# Altium schematic sheet Spindle_Control.SchDoc: STM32F446 CNC
size B; Author: AM; CompanyName: Expatria Technologies; DrawnBy: A.Marles; Engineer: AM; Organization: Expatria Technolgoies; DocumentNumber: 5; SheetNumber: 5; SheetTotal: 14
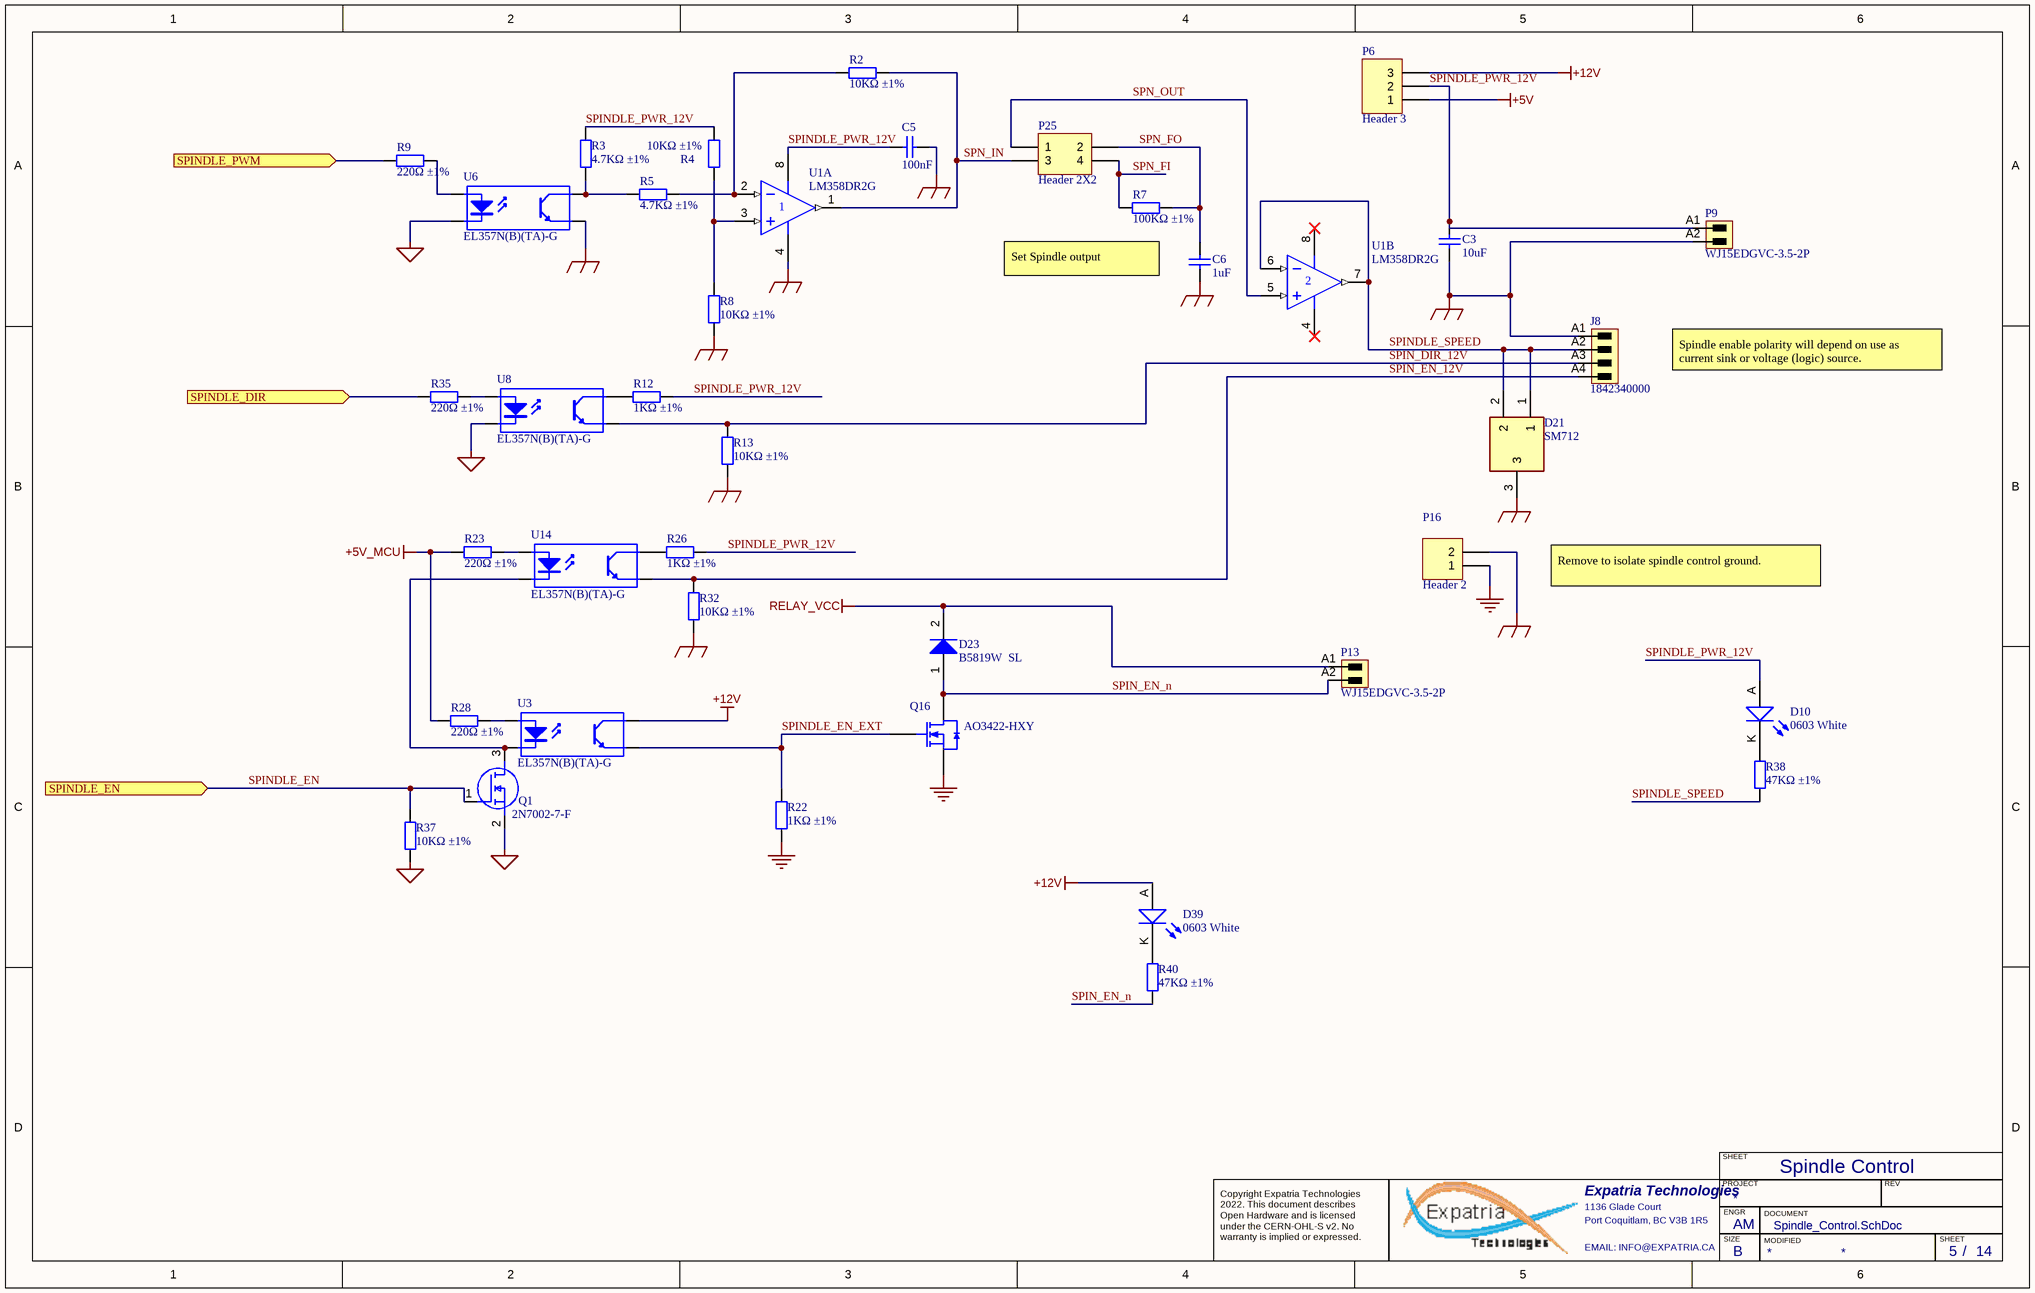
[diagram p0: Spindle_Control.SchDoc]

## Parts
C3  10uF  [1206_C]
C5  100nF  [0603_C]
C6  1uF  [0603_C]
D10  0603 White  [0603_LED_S1]
D21  SM712  [SOT95P230X117-3N]
D23  B5819W  SL  [SOD-123]
D39  0603 White  [0603_LED_S1]
J8  1842340000  [691321100004]
P6  Header 3  [HDR1X3]
P9  WJ15EDGVC-3.5-2P  [691321100002]
P13  WJ15EDGVC-3.5-2P  [691321100002]
P16  Header 2  [HDR1X2]
P25  Header 2X2  [HDR2X2]
Q1  2N7002-7-F  [SOT-23(SOT-23-3)]
Q16  AO3422-HXY  [SOT-23-3L]
R2  10KΩ ±1%  [0603_R]
R3  4.7KΩ ±1%  [0603_R]
R4  10KΩ ±1%  [0603_R]
R5  4.7KΩ ±1%  [0603_R]
R7  100KΩ ±1%  [0603_R]
R8  10KΩ ±1%  [0603_R]
R9  220Ω ±1%  [0402_R]
R12  1KΩ ±1%  [0603_R]
R13  10KΩ ±1%  [0603_R]
R22  1KΩ ±1%  [0603_R]
R23  220Ω ±1%  [0603_R]
R26  1KΩ ±1%  [0603_R]
R28  220Ω ±1%  [0603_R]
R32  10KΩ ±1%  [0603_R]
R35  220Ω ±1%  [0402_R]
R37  10KΩ ±1%  [0603_R]
R38  47KΩ ±1%  [0603_R]
R40  47KΩ ±1%  [0603_R]
U1  LM358DR2G  [SOIC-8_150mil]  (parts A,B of 2)
U3  EL357N(B)(TA)-G  [SOP-4_P2.54]
U6  EL357N(B)(TA)-G  [SOP-4_P2.54]
U8  EL357N(B)(TA)-G  [SOP-4_P2.54]
U14  EL357N(B)(TA)-G  [SOP-4_P2.54]

## Ports
SPINDLE_DIR (in), SPINDLE_EN (in), SPINDLE_PWM (in)

## Nets
+5V: P6.1
+5V_MCU: R23.1 R28.1
+12V: D39.A P6.3 U3.4(C)
GND: P16.1 Q16.2(S) R22.1
MCU_GND: Q1.2(S) R37.2 U6.2(K) U8.2(K)
RELAY_VCC: D23.2(K) P13.A1
SPIN_GND: C3.1 C5.1 C6.1 D21.3 J8.A1 P9.A2 P16.2 R8.2 R13.2 R32.2 U1.4(V-) U6.3(E)
SPIN_DIR_12V: J8.A3 R13.1 U8.3(E)
SPIN_EN_12V: J8.A4 R32.1 U14.3(E)
SPIN_EN_n: D23.1(A) P13.A2 Q16.3(D) R40.1
SPINDLE_DIR: R35.1 ; port SPINDLE_DIR
SPINDLE_EN: Q1.1(G) R37.1 ; port SPINDLE_EN
SPINDLE_EN_EXT: Q16.1(G) R22.2 U3.3(E)
SPINDLE_PWM: R9.1 ; port SPINDLE_PWM
SPINDLE_PWR_12V: C3.2 C5.2 D10.A P6.2 P9.A1 R3.1 R4.1 R12.1 R26.1 U1.8(V+)
SPINDLE_SPEED: D21.1 D21.2 J8.A2 R38.1 U1.6(IN-) U1.7(OUT)
SPN_FI: P25.4 R7.2
SPN_FO: C6.2 P25.2 R7.1
SPN_IN: P25.3 R2.2 U1.1(OUT)
SPN_OUT: P25.1 U1.5(IN+)
NetD10_K: D10.K R38.2
NetD39_K: D39.K R40.2
NetQ1_3: Q1.3(D) U3.2(K) U14.2(K)
NetR2_1: R2.1 R5.2 U1.2(IN-)
NetR3_2: R3.2 R5.1 U6.4(C)
NetR4_2: R4.2 R8.1 U1.3(IN+)
NetR9_2: R9.2 U6.1(A)
NetR12_2: R12.2 U8.4(C)
NetR23_2: R23.2 U14.1(A)
NetR26_2: R26.2 U14.4(C)
NetR28_2: R28.2 U3.1(A)
NetR35_2: R35.2 U8.1(A)

## Notes on the sheet
- Set Spindle output
- Spindle enable polarity will depend on use as current sink or voltage (logic) source.
- Remove to isolate spindle control ground.
- Spindle Control
- SHEET
- Expatria Technologies
- 1136 Glade Court
- Port Coquitlam, BC V3B 1R5
- PROJECT
- SIZE
- ENGR
- MODIFIED
- DOCUMENT
- REV
- Copyright Expatria Technologies 2022. This document describes Open Hardware and is licensed under the CERN-OHL-S v2. No warranty is implied or expressed.
- EMAIL: INFO@EXPATRIA.CA
- B
- /

## Library data of the parts
C3 = 1206 10uF (106) 10% 50V: Chip capacitors; Manufacturer: Samsung Electro-Mechanics; PartNumber: CL31A106KBHNNNE; Tolerance: 10%; Voltage: 50V; Package: 1206; Supplier: LC; SuppliersPartNumber: C13585; Capacitance: 10uF; Manufacturer 1: Samsung Electro-Mechanics
C5 = 0603 100nF (104) 10% 50V: Chip capacitors; Manufacturer: YAGEO; PartNumber: CC0603KRX7R9BB104; Tolerance: 10%; Voltage: 50V; Package: 0603; Supplier: LC; SuppliersPartNumber: C14663; Capacitance: 100nF; Manufacturer 1: YAGEO
C6 = 0603 1uF (105) 10% 50V: Chip capacitors; Manufacturer: Samsung Electro-Mechanics; PartNumber: CL10A105KB8NNNC; Tolerance: 10%; Voltage: 50V; Package: 0603; Supplier: LC; SuppliersPartNumber: C15849; Capacitance: 1uF; Manufacturer 1: Samsung Electro-Mechanics
D10 D39 = 0603 LED White: LED; ComponentLink1Description: 供应商链接; ComponentLink1URL: http://www.szlcsc.com/product/details_2663.html; Package: 0603; Supplier: LC; SuppliersPartNumber: C2290; Color: White
D21 = CDSOT23-SM712: Bidirectional 12V (Max), 7V (Max) 7.5V / 13.3V 10V / 20V 12A(8/20us) SOT-23-3 TVS RoHS; Manufacturer_Name: DOWO; Height: 1.17mm; Manufacturer_Part_Number: SM712; SuppliersPartNumber: C293966; Manufacturer 1: DOWO; Manufacturer Part Number 1: SM712; Package: SOT-23-3
D23 = SOD-123 B5819W  SL: Schottky Diode; ComponentLink1Description: 供应商链接; ComponentLink1URL: http://www.szlcsc.com/product/details_9093.html; Package: SOD-123; Supplier: LC; SuppliersPartNumber: C8598
J8 = 3.5mm Terminal Header 4p: OMNIMATE Signal - series BL/SL 3.50; Revision: V1; SuppliersPartNumber: C880556; ComponentLink1URL: http://www.weidmueller.com/; ComponentLink1Description: Manufacturer URL; Supplier: LCSC
P6 = Header 3: Header, 3-Pin; Publisher: Altium Limited; SuppliersPartNumber: C49257
P9 P13 = 3.5mm Terminal Header 2p: Header,Male Pin,Covered(4 Sided) 2 1 0.138"（3.50mm） 2 P=3.5mm Pluggable System Terminal Block RoHS; Manufacturer: Ningbo Kangnex Elec; UL_94_flammability_rating: V-0; Pitch_mm: 3.5 mm; Side_termination_characteristic: closed side; Pitch_inch: 0.138 inch; Solder_pin_length_mm: 3.2 mm; Short_text_for_material: SL 3.50/02/180G 3.2SN OR BX; PartNumber: WJ15EDGVC-3.5-2P; Revision: V1; PackageReference: SL_3_50_180G_02; Packaging: Box; SuppliersPartNumber: C192777; ComponentLink1Description: Manufacturer URL; ComponentLink1URL: http://www.weidmueller.com/; Manufacturer 1: Ningbo Kangnex Elec; Manufacturer Part Number 1: WJ15EDGVC-3.5-2P
P16 = Header 2: Header, 2-Pin; Publisher: Altium Limited; LatestRevisionDate: 17-Jul-2002; LatestRevisionNote: Re-released for DXP Platform.; SuppliersPartNumber: C234182
P25 = Header 2X2: Header, 2-Pin, Dual row; Supplier: LC; SuppliersPartNumber: C66690
Q1 = 2N7002-7-F: 60V 115mA 7.5Ω@5V,50mA 370mW N Channel SOT-23 MOSFETs ROHS; Manufacturer: Diodes Inc.; SuppliersPartNumber: C85049; Manufacturer Part Number: 2N7002-7-F; Value: 2N7002-7-F; Datasheet Link: https://datasheet.datasheetarchive.com/originals/distributors/SFDatasheet-0/sf-0003625.pdf; Height: 1.2mm; Manufacturer_Part_Number: 2N7002-7-F; Mouser Part Number: 621-2N7002-F; Mouser Price/Stock: https://www.mouser.co.uk/ProductDetail/Diodes-Incorporated/2N7002-7-F?qs=jMXWnm70%252BC%252BAX%252BMLzUkTZg%3D%3D; Arrow Part Number: 2N7002-7-F; Arrow Price/Stock: https://www.arrow.com/en/products/2n7002-7-f/diodes-incorporated?region=nac
Q16 = AO3400A N道沟 X0YV1T SOT-23: 60V 4.5A 8W 75mΩ@10V,5A 2.5V@250uA N Channel 695pF@15V SOT-23-3L MOSFETs ROHS; ComponentLink1Description: 供应商链接; ComponentLink1URL: http://www.szlcsc.com/product/details_21629.html; Package: SOT-23L; Supplier: LC; SuppliersPartNumber: C4748727
R2 R4 R8 R13 R32 R37 = 0603 10K (1002) 1%: Chip resistor; Manufacturer: Uniroyal Elec; PartNumber: 0603WAF1002T5E; Power: 1/10W; Package: 0603; Supplier: LC; SuppliersPartNumber: C25804; Resistance: 10KΩ; Tolerance: 1%; ComponentLink1Description: Supplier link; ComponentLink1URL: http://www.szlcsc.com/product/details_26547.html
R3 R5 = 0603 4.7K (4701) 1%: Chip resistor; Manufacturer: Uniroyal Elec; PartNumber: 0603WAF4701T5E; Power: 1/10W; Package: 0603; Supplier: LC; SuppliersPartNumber: C23162; Resistance: 4.7KΩ; Tolerance: 1%; ComponentLink1Description: Supplier link; ComponentLink1URL: http://www.szlcsc.com/product/details_23889.html
R7 = 0603 100K (1003) 1%: Chip resistor; Manufacturer: Uniroyal Elec; PartNumber: 0603WAF1003T5E; Power: 1/10W; Package: 0603; Supplier: LC; SuppliersPartNumber: C25803; Resistance: 100KΩ; Tolerance: 1%; ComponentLink1Description: Supplier link; ComponentLink1URL: http://www.szlcsc.com/product/details_26546.html
R9 R35 = 0402 220R (2200) 1%: Chip resistor; Manufacturer: Uniroyal Elec; PartNumber: 0402WGF2200TCE; Power: 1/16W; Package: 0402; Supplier: LC; SuppliersPartNumber: C25091; Resistance: 220Ω; Tolerance: 1%; ComponentLink1Description: Supplier link; ComponentLink1URL: http://www.szlcsc.com/product/details_25834.html
R12 R22 R26 = 0603 1K (1001) 1%: Chip resistor; Manufacturer: Uniroyal Elec; PartNumber: 0603WAF1001T5E; Power: 1/10W; Package: 0603; Supplier: LC; SuppliersPartNumber: C21190; Resistance: 1KΩ; Tolerance: 1%; ComponentLink1Description: Supplier link; ComponentLink1URL: http://www.szlcsc.com/product/details_21904.html
R23 R28 = 0603 220R (2200) 1%: Chip resistor; Manufacturer: Uniroyal Elec; PartNumber: 0603WAF2200T5E; Power: 1/10W; ComponentLink1Description: Supplier link; ComponentLink1URL: http://www.szlcsc.com/product/details_23689.html; Package: 0603; Supplier: LC; SuppliersPartNumber: C22962; Resistance: 220Ω; Tolerance: 1%
R38 R40 = 0603 47K (4702) 1%: Chip resistor; Manufacturer: Uniroyal Elec; PartNumber: 0603WAF4702T5E; Power: 1/10W; ComponentLink1Description: Supplier link; ComponentLink1URL: http://www.szlcsc.com/product/details_26562.html; Package: 0603; Supplier: LC; SuppliersPartNumber: C25819; Resistance: 47KΩ; Tolerance: 1%
U1 = LM358DR2G_[C7950]: Dual Op Amp,  5 - 28 V,  8-PinSOIC; Manufacturer 1: ON Semiconductor; Package: SOIC-8; Supplier: LC; SuppliersPartNumber: C7950; Manufacturer Part Number 1: LM358DR2G; Packaging: Tape and Reel; Length: 5mm
U3 U6 U8 U14 = EL357N(B)(TA)-G_[C6649]: OPTOISOLATOR 3.75KV TRANS 4-SOP; Manufacturer 1: Everlight Elec; Package: SOP-4_P2.54; Supplier: LC; SuppliersPartNumber: C6649; Manufacturer Part Number 1: EL357N(B)(TA)-G
  U3: ComponentLink1Description: 供应商链接; ComponentLink1URL: http://www.szlcsc.com/product/details_7114.html